# Altium schematic sheet Digital.SchDoc
size Letter; SheetNumber: 3; SheetTotal: 3
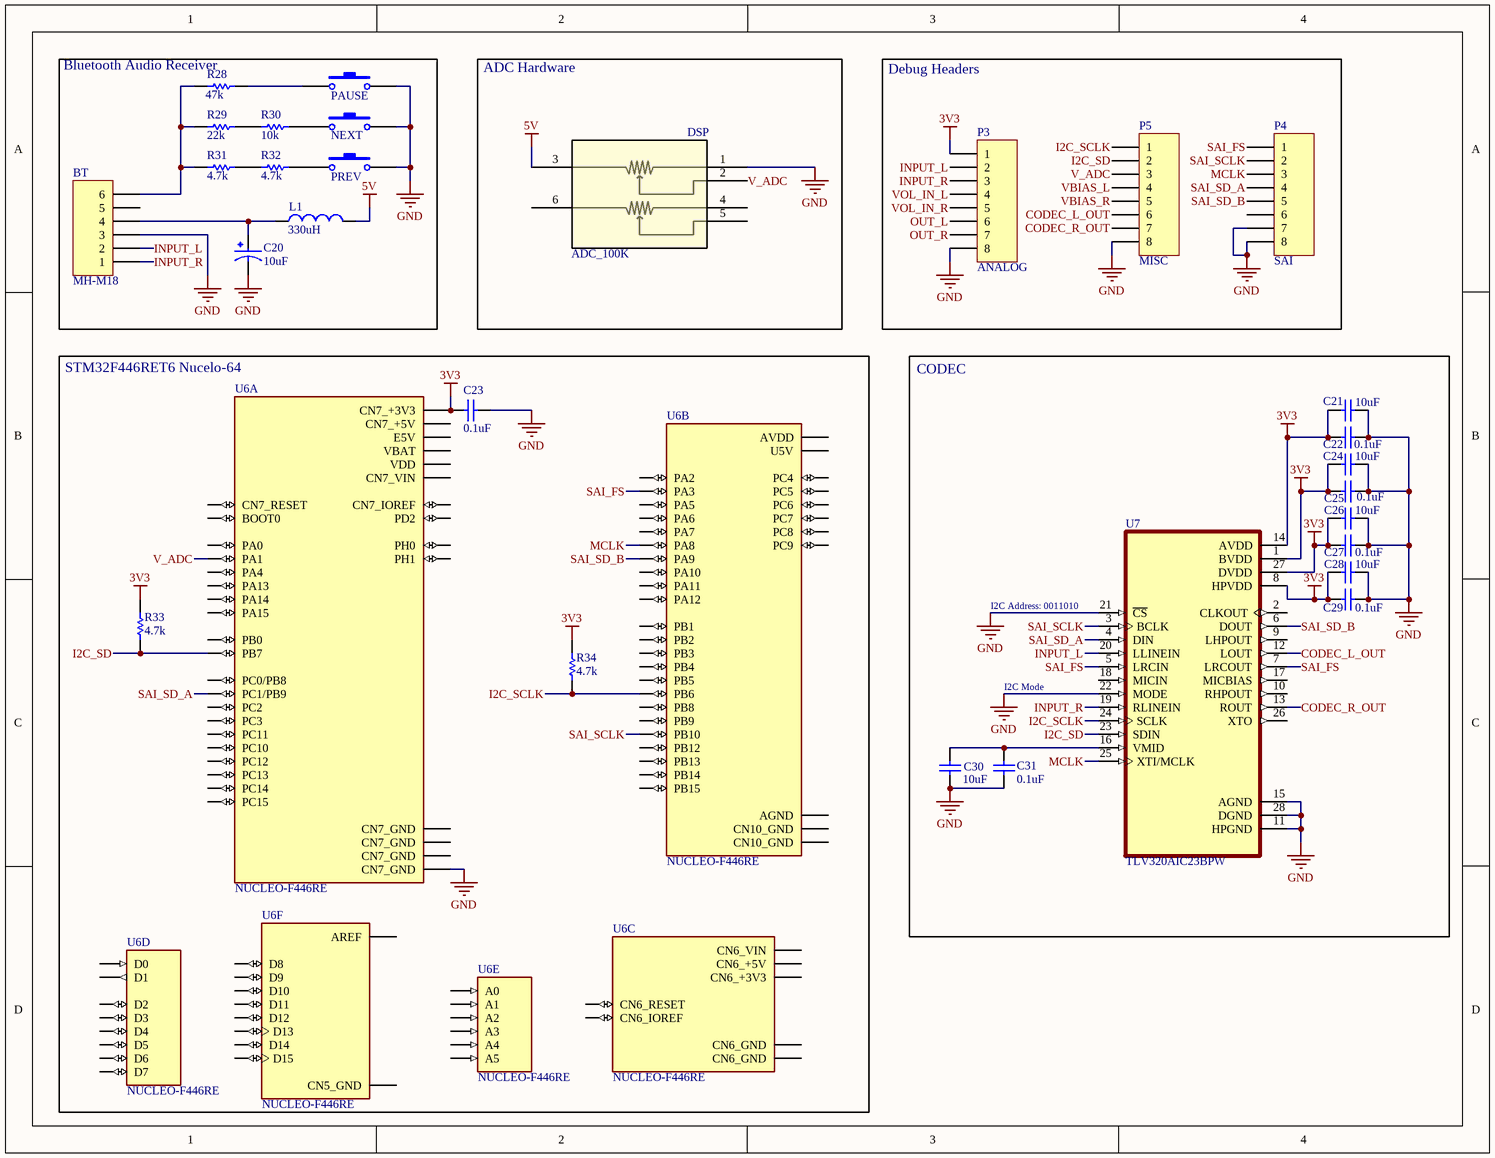
[diagram p0: Digital.SchDoc]

## Parts
BT  MH-M18  [HDR1X6]
C20  10uF  [CAPPRD200W50D500H1500]
C21  value 10uF  [RAD-0.1]  (hidden comment: Cap)
C22  value 0.1uF  [RAD-0.1]  (hidden comment: Cap)
C23  value 0.1uF  [RAD-0.1]  (hidden comment: Cap)
C24  value 10uF  [RAD-0.1]  (hidden comment: Cap)
C25  value 0.1uF  [RAD-0.1]  (hidden comment: Cap)
C26  value 10uF  [RAD-0.1]  (hidden comment: Cap)
C27  value 0.1uF  [RAD-0.1]  (hidden comment: Cap)
C28  value 10uF  [RAD-0.1]  (hidden comment: Cap)
C29  value 0.1uF  [RAD-0.1]  (hidden comment: Cap)
C30  value 10uF  [RAD-0.1]  (hidden comment: Cap)
C31  value 0.1uF  [RAD-0.1]  (hidden comment: Cap)
DSP  ADC_100K  [Bourns_PDB182-K425K-103A_0]
L1  value 330uH  [RAD-0.4]  (hidden comment: Inductor)
NEXT  NEXT  [SW PB]  (value not drawn)
P3  ANALOG  [HDR1X8]
P4  SAI  [HDR1X8]
P5  MISC  [HDR1X8]
PAUSE  PAUSE  [SW PB]  (value not drawn)
PREV  PREV  [SW PB]  (value not drawn)
R28  value 47k  [AXIAL-0.3]  (hidden comment: Res1)
R29  value 22k  [AXIAL-0.3]  (hidden comment: Res1)
R30  value 10k  [AXIAL-0.3]  (hidden comment: Res1)
R31  value 4.7k  [AXIAL-0.3]  (hidden comment: Res1)
R32  value 4.7k  [AXIAL-0.3]  (hidden comment: Res1)
R33  value 4.7k  [AXIAL-0.3]  (hidden comment: Res1)
R34  value 4.7k  [AXIAL-0.3]  (hidden comment: Res1)
U6  NUCLEO-F446RE  [MODULE_NUCLEO-F446RE]  (parts A,B,C,D,E,F of 6)
U7  TLV320AIC23BPW  [SOP65P640X120-28N]

## Blocks framed on the sheet
Bluetooth Audio Receiver: BT C20 L1 NEXT PAUSE PREV R28-R32
ADC Hardware: DSP
Debug Headers: P3-P5
STM32F446RET6 Nucelo-64: C23 R33 R34 U6
CODEC: C21 C22 C24-C31 U7

## Nets
3V3: C21.1 C22.1 C23.1 C24.1 C25.1 C26.1 C27.2 C28.1 C29.2 P3.1 R33.2 R34.2 U6.CN7_16(CN7_+3V3) U7.1(BVDD) U7.8(HPVDD) U7.14(AVDD) U7.27(DVDD)
5V: DSP.3 L1.2
GND: BT.3 C20.N C21.2 C22.2 C23.2 C24.2 C25.2 C26.2 C27.1 C28.2 C29.1 C30.1 C31.1 DSP.1 NEXT.2 P3.8 P4.7 P4.8 P5.8 PAUSE.2 PREV.2 U6.CN7_22(CN7_GND) U7.11(HPGND) U7.15(AGND) U7.21(~{CS}) U7.22(MODE) U7.28(DGND)
CODEC_L_OUT: P5.6 U7.12(LOUT)
CODEC_R_OUT: P5.7 U7.13(ROUT)
I2C_SCLK: P5.1 R34.1 U6.CN10_17(PB6) U7.24(SCLK)
I2C_SD: P5.2 R33.1 U6.CN7_21(PB7) U7.23(SDIN)
INPUT_L: BT.2 P3.2 U7.20(LLINEIN)
INPUT_R: BT.1 P3.3 U7.19(RLINEIN)
MCLK: P4.3 U6.CN10_23(PA8) U7.25(XTI/MCLK)
OUT_L: P3.6
OUT_R: P3.7
SAI_FS: P4.1 U6.CN10_37(PA3) U7.5(LRCIN) U7.7(LRCOUT)
SAI_SCLK: P4.2 U6.CN10_25(PB10) U7.3(BCLK)
SAI_SD_A: P4.4 U6.CN7_36(PC1/PB9) U7.4(DIN)
SAI_SD_B: P4.5 U6.CN10_21(PA9) U7.6(DOUT)
V_ADC: DSP.2 P5.3 U6.CN7_30(PA1)
VBIAS_L: P5.4
VBIAS_R: P5.5
VOL_IN_L: P3.4
VOL_IN_R: P3.5
NetBT_4: BT.4 C20.P L1.1
NetBT_6: BT.6 R28.1 R29.1 R31.1
NetC30_2: C30.2 C31.2 U7.16(VMID)
NetNEXT_1: NEXT.1 R30.2
NetPAUSE_1: PAUSE.1 R28.2
NetPREV_1: PREV.1 R32.2
NetR29_2: R29.2 R30.1
NetR31_2: R31.2 R32.1

Not connected (* = marked no-connect by the designer): BT 5; DSP 4(6) 5 6(4); P4 6; U6 CN5_1(D8) CN5_2(D9) CN5_3(D10) CN5_4(D11) CN5_5(D12) CN5_6(D13) CN5_7(CN5_GND) CN5_8(AREF) CN5_9(D14) CN5_10(D15) CN6_2(CN6_IOREF) CN6_3(CN6_RESET) CN6_4(CN6_+3V3) CN6_5(CN6_+5V) CN6_6(CN6_GND) CN6_7(CN6_GND) CN6_8(CN6_VIN) CN7_1(PC10) CN7_2(PC11) CN7_3(PC12) CN7_4(PD2) CN7_5(VDD) CN7_6(E5V) CN7_7(BOOT0) CN7_8(CN7_GND) CN7_12(CN7_IOREF) CN7_13(PA13) CN7_14(CN7_RESET) CN7_15(PA14) CN7_17(PA15) CN7_18(CN7_+5V) CN7_19(CN7_GND) CN7_20(CN7_GND) CN7_23(PC13) CN7_24(CN7_VIN) CN7_25(PC14) CN7_27(PC15) CN7_28(PA0) CN7_29(PH0) CN7_31(PH1) CN7_32(PA4) CN7_33(VBAT) CN7_34(PB0) CN7_35(PC2) CN7_37(PC3) CN7_38(PC0/PB8) CN8_1(A0) CN8_2(A1) CN8_3(A2) CN8_4(A3) CN8_5(A4) CN8_6(A5) CN9_1(D0) CN9_2(D1) CN9_3(D2) CN9_4(D3) CN9_5(D4) CN9_6(D5) CN9_7(D6) CN9_8(D7) CN10_1(PC9) CN10_2(PC8) CN10_3(PB8) CN10_4(PC6) CN10_5(PB9) CN10_6(PC5) CN10_7(AVDD) CN10_8(U5V) CN10_9(CN10_GND) CN10_11(PA5) CN10_12(PA12) CN10_13(PA6) CN10_14(PA11) CN10_15(PA7) CN10_16(PB12) CN10_19(PC7) CN10_20(CN10_GND) CN10_22(PB2) CN10_24(PB1) CN10_26(PB15) CN10_27(PB4) CN10_28(PB14) CN10_29(PB5) CN10_30(PB13) CN10_31(PB3) CN10_32(AGND) CN10_33(PA10) CN10_34(PC4) CN10_35(PA2); U7 2(CLKOUT) 9(LHPOUT) 10(RHPOUT) 17(MICBIAS) 18(MICIN) 26(XTO)

## Notes on the sheet
- (near U7) I2C Address: 0011010
- I2C Mode

## Library data of the parts
BT = Header 6: Header, 6-Pin; LatestRevisionDate: 17-Jul-2002; LatestRevisionNote: Re-released for DXP Platform.; Publisher: Altium Limited
C20 = EEUFC1J101: Capacitor; Aluminum Electrolytic; Radial Al Electrolytic Cap; 100uF 63V; MF: Panasonic Electronic; MP: EEU-FC1J101; Package: RADIAL-2 Panasonic; Price: None; Check_prices: https://www.snapeda.com/parts/EEU-FC1J101/Panasonic%20Electronic%20Components/view-part/494707/?ref=eda; Value: *; SnapEDA_Link: https://www.snapeda.com/parts/EEU-FC1J101/Panasonic%20Electronic%20Components/view-part/494707/?ref=snap; Availability: In Stock
C21-C31 = Cap: Capacitor; Published: 8-Jun-2000; LatestRevisionDate: 17-Jul-2002; LatestRevisionNote: Re-released for DXP Platform.; PackageReference: RAD-0.3; Publisher: Altium Limited; PackageDescription: Radial Cap, Thru-Hole; 2 Leads; 0.3 in Pin Spacing
DSP = PDB182-K420K-103A2: No Description Available; Mfr_Name: Bourns Electronics; Copyright: Copyright (C) 2022 Ultra Librarian. All rights reserved.; Manufacturer_Part_Number: PDB182-K420K-103A2; RefDes: RefDes; Type: DEV
L1 = Inductor: Code_IEC: 1005; Published: 8-Jun-2000; LatestRevisionDate: 29-May-2009; LatestRevisionNote: IPC-7351 Footprint Added.; PackageReference: 0402-A; Publisher: Altium Limited; PackageDescription: Chip Inductor; Code_JEITA: 0402
NEXT PAUSE PREV = SW-PB: Switch; Published: 24-Mar-1999; LatestRevisionDate: 17-Jul-2002; LatestRevisionNote: Re-released for DXP Platform.; PackageReference: SPST-2; Publisher: Altium Limited; PackageDescription: Switch; 2 Leads
P3-P5 = Header 8: Header, 8-Pin; LatestRevisionDate: 17-Jul-2002; LatestRevisionNote: Re-released for DXP Platform.; Publisher: Altium Limited
R28-R34 = Res1: Resistor; Published: 8-Jun-2000; LatestRevisionDate: 17-Jul-2002; LatestRevisionNote: Re-released for DXP Platform.; PackageReference: AXIAL-0.3; Publisher: Altium Limited; PackageDescription: Axial Device, Thru-Hole; 2 Leads; 0.3 in Pin Spacing
U6 = NUCLEO-F446RE: STM32 Nucleo-64 development board with STM32F446RET6 MCU, supports Arduino and ST morpho connectivity; Price: None; MP: NUCLEO-F446RE; Value: *; Availability: Unavailable; Package: None
U7 = TLV320AIC23BPW: Low-Power Stereo CODEC with HP Amplifier 28-TSSOP -10 to 70; MF: Texas Instruments; Availability: Warning; Package: TSSOP-28 Texas Instruments; MP: TLV320AIC23BPW; Texas_Instruments-Purchase-URL: https://snapeda.com/shop?store=Texas+Instruments&id=249064; DigiKey-Purchase-URL: https://snapeda.com/shop?store=DigiKey&id=249064; Value: *; Arrow_Electronics-Purchase-URL: https://snapeda.com/shop?store=Arrow+Electronics&id=249064; Mouser-Purchase-URL: https://snapeda.com/shop?store=Mouser&id=249064; Price: None; SnapEDA_Link: https://www.snapeda.com/parts/TLV320AIC23BPW/Texas%20Instruments/view-part/249064/?ref=snap